# EAGLE design adapter (EAGLE 9.3.0)
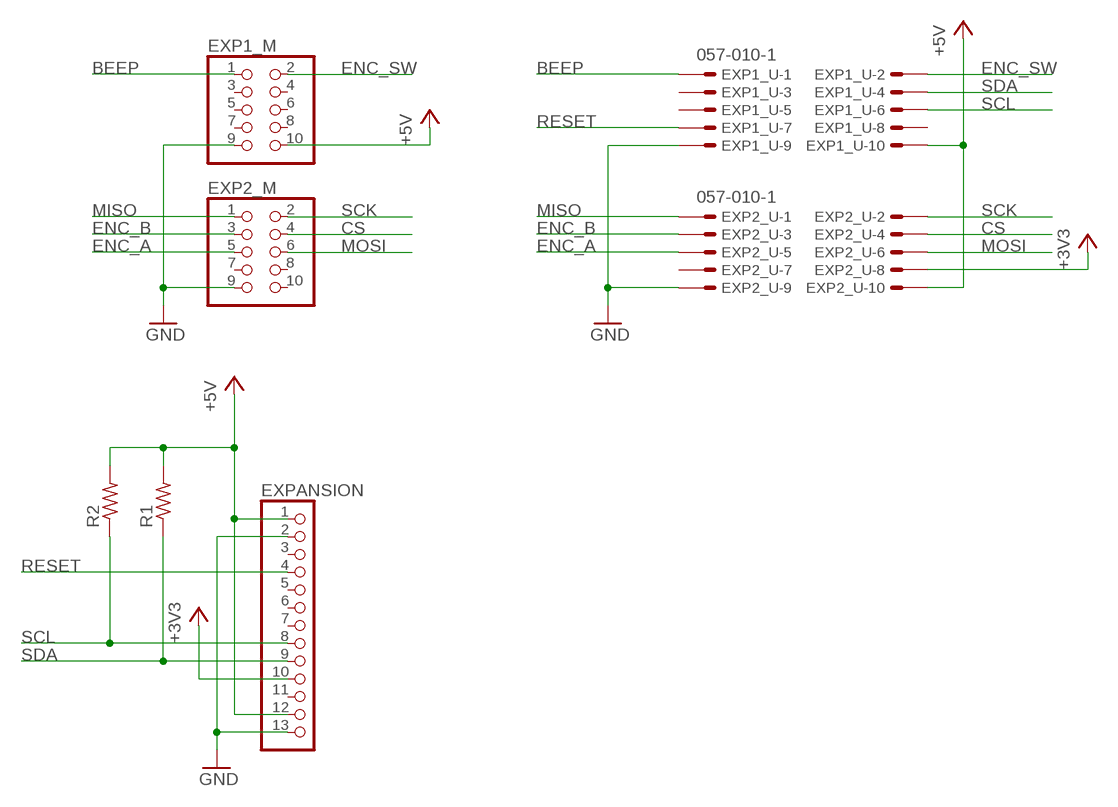
[diagram p0: schematic, sheet 1]

## Parts
EXP1_M  PINHD-2X5  [2X05]
EXP1_U  057-010-1  [057-010-1]
EXP2_M  PINHD-2X5  [2X05]
EXP2_U  057-010-1  [057-010-1]
EXPANSION  PINHD-1X13  [1X13]
R1  R-US_0204/7  [0204/7]
R2  R-US_0204/7  [0204/7]

## Nets
+3V3: EXP2_U.8 EXPANSION.10
+5V: EXP1_M.10 EXP1_U.10 EXP2_U.10 EXPANSION.1 EXPANSION.12 R1.2 R2.2
BEEP: EXP1_M.1 EXP1_U.1
CS: EXP2_M.4 EXP2_U.4
ENC_A: EXP2_M.5 EXP2_U.5
ENC_B: EXP2_M.3 EXP2_U.3
ENC_SW: EXP1_M.2 EXP1_U.2
GND: EXP1_M.9 EXP1_U.9 EXP2_M.9 EXP2_U.9 EXPANSION.2 EXPANSION.13
MISO: EXP2_M.1 EXP2_U.1
MOSI: EXP2_M.6 EXP2_U.6
RESET: EXP1_U.7 EXPANSION.4
SCK: EXP2_M.2 EXP2_U.2
SCL: EXP1_U.6 EXPANSION.8 R2.1
SDA: EXP1_U.4 EXPANSION.9 R1.1
Unconnected: EXP1_M.3 EXP1_M.4 EXP1_M.5 EXP1_M.6 EXP1_M.7 EXP1_M.8 EXP1_U.3 EXP1_U.5 EXP1_U.8 EXP2_M.7 EXP2_M.8 EXP2_M.10 EXP2_U.7 EXPANSION.3 EXPANSION.5 EXPANSION.6 EXPANSION.7 EXPANSION.11

## Library data of the parts
EXP1_M EXP2_M = pinhead:PINHD-2X5: PIN HEADER
EXP1_U EXP2_U = con-panduit:057-010-: CONNECTOR 10-pin series 057 contact pc board low profile headers; OC_FARNELL: unknown; OC_NEWARK: unknown
EXPANSION = pinhead:PINHD-1X13: PIN HEADER
R1 R2 = resistor:R-US_: RESISTOR, American symbol

## Board
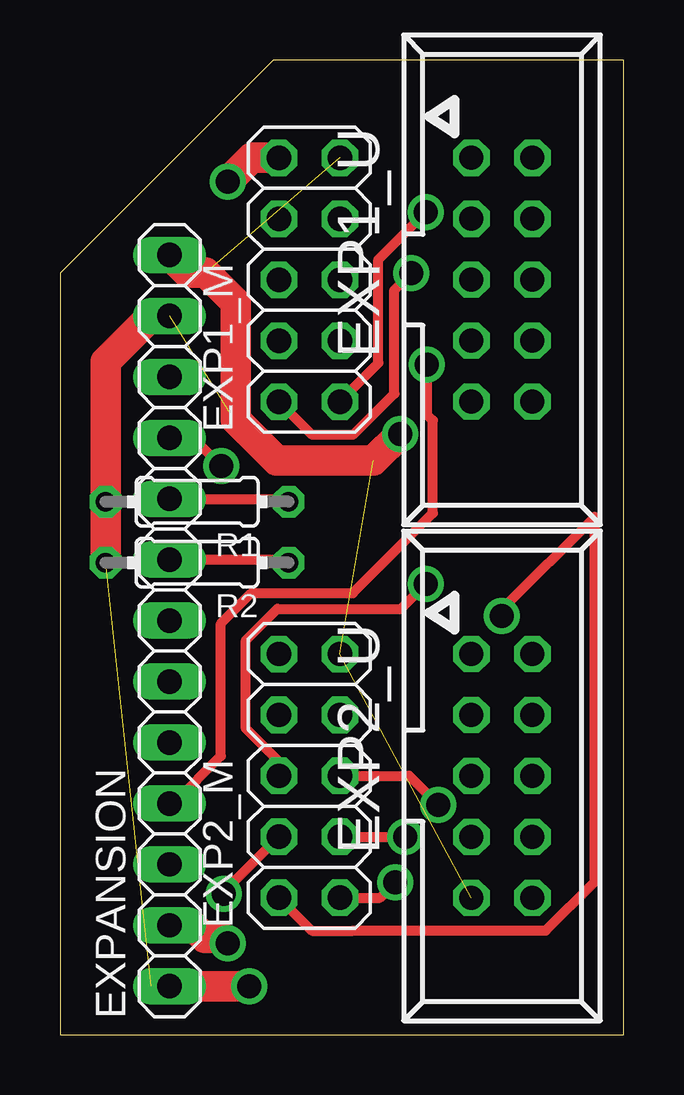
[diagram p1: board, top side]
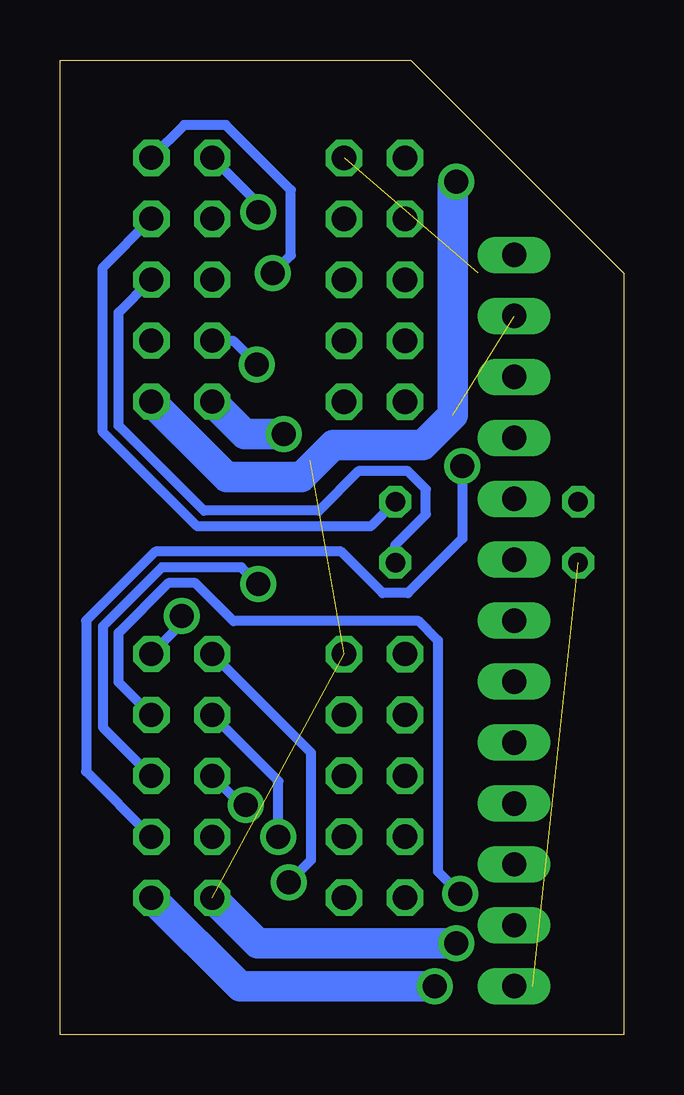
[diagram p2: board, bottom side, seen from below]

Size 23.5 x 40.64 mm. Coordinates in mm from the lower left corner, seen from the top.
Outline: 23.5,0 23.5,40.64 8.89,40.64 0,31.75 0,0 23.5,0
Copper layers (1*16): Top 0.035mm / dielectric 1.5mm / Bottom 0.035mm
Design rules "default *": minimum track width 6mil, minimum drill 0.4mm, track to track 10mil, track to pad 16mil, pad to pad 10mil, via to via 16mil, smd to smd 10mil, copper to edge 40mil, drill to drill 6mil, minimum pad ring 10mil, minimum via ring 8mil, stop-mask expansion 4mil, vias tented up to drill 0mil, thermal gap 10mil

### Footprints (pad centres in the part's own frame; a part is rotated, then mirrored left to right if it is on the bottom)
2X05 = drill 1.016 octagon: 1 -5.08,-1.27; 2 -5.08,1.27; 3 -2.54,-1.27; 4 -2.54,1.27; 5 0,-1.27; 6 0,1.27; 7 2.54,-1.27; 8 2.54,1.27; 9 5.08,-1.27; 10 5.08,1.27
057-010-1 = drill 1 octagon: 1 -5.08,-1.27; 2 -5.08,1.27; 3 -2.54,-1.27; 4 -2.54,1.27; 5 0,-1.27; 6 0,1.27; 7 2.54,-1.27; 8 2.54,1.27; 9 5.08,-1.27; 10 5.08,1.27
1X13 = drill 1.016 long: 1 -15.24,0; 2 -12.7,0; 3 -10.16,0; 4 -7.62,0; 5 -5.08,0; 6 -2.54,0; 7 0,0; 8 2.54,0; 9 5.08,0; 10 7.62,0; 11 10.16,0; 12 12.7,0; 13 15.24,0
0204/7 = drill 0.813 octagon: 1 -3.81,0; 2 3.81,0

### Placement (x,y rotation side)
EXP1_M  10.39,31.48 90 top
EXP1_U  18.41,31.48 270 top
EXP2_M  10.39,10.8 90 top
EXP2_U  18.41,10.8 270 top
EXPANSION  4.57,17.27 90 top
R1  5.72,22.22 180 top
R2  5.72,19.69 180 top

### Tracks (layer width: path | path; a pad name or v marks a point on that pad's centre or on a via)
+3V3  (via drill 1)
  Top 0.406: v6.73,23.71 5.55,24.89 EXPANSION.10
  Bottom 0.406: EXP2_U.8 22.4,10.98 22.4,17.27 19.53,20.15 11.78,20.15 10.05,18.41 9,18.41 6.73,20.69 v6.73,23.71 6.73,23.62
+5V  (via drill 1)  (2 unrouted)
  Top 1.27: 3.8,2.03 EXPANSION.1 v7.89,2.03 | R2.2 R1.2 1.91,28.08 3.8,29.97 EXPANSION.12 | EXP1_M.10 7.98,36.56 v6.98,35.56
  Bottom 1.27: EXP1_U.10 16.55,23.26 13.44,23.26 12.1,24.59 8.37,24.59 7.13,25.83 7.13,35.41 v6.98,35.56 | v7.89,2.03 16,2.03 EXP2_U.10
BEEP  (via drill 1)
  Top 0.406: EXP1_M.1 13.27,28.01 13.27,32.32 v15.24,34.29 v15.23,34.29
  Bottom 0.406: v15.23,34.29 15.23,34.65 EXP1_U.1
CS  (via drill 1)
  Top 0.406: EXP2_M.4 6.82,5.96 v6.82,5.88
  Bottom 0.406: EXP2_U.4 21.05,14.7 21.05,16.76 18.98,18.83 17.85,18.83 16.27,17.25 8.55,17.25 7.75,16.45 7.75,6.81 v6.82,5.88
ENC_A  (via drill 1)
  Top 0.406: EXP2_M.5 14.55,10.8 v15.75,9.59
  Bottom 0.406: v15.75,9.59 15.94,9.59 EXP2_U.5
ENC_B  (via drill 1)
  Top 0.406: EXP2_M.3 v14.39,8.26
  Bottom 0.406: v14.39,8.26 14.39,10.58 EXP2_U.3
ENC_SW  (via drill 1)
  Top 0.406: EXP1_M.2 10.49,25.03 12.23,25.03 13.93,26.73 13.93,31.05 v14.63,31.75
  Bottom 0.406: EXP1_U.2 18.32,37.92 16.58,37.92 13.88,35.22 13.88,32.5 v14.63,31.75
GND  (via drill 1)  (3 unrouted)
  Top 1.27: EXPANSION.13 5.31,31.77 6.08,31.77 7.32,30.53 7.32,25.65 9.03,23.93 13.06,23.93 v14.18,25.05 | EXPANSION.2 5.51,4.57 6.03,4.05 6.76,4.05 v6.98,3.82
  Bottom 1.27: v14.18,25.05 15.8,25.05 EXP1_U.9 | v6.98,3.82 15.25,3.82 EXP2_U.9
MISO  (via drill 1)
  Top 0.406: EXP2_M.1 13.34,5.72 v13.97,6.35
  Bottom 0.406: v13.97,6.35 13.03,7.29 13.03,11.77 EXP2_U.1
MOSI  (via drill 1)
  Top 0.406: EXP2_M.6 9.12,11.4 7.75,12.77 7.75,16.45 9.06,17.75 14.2,17.75 v15.24,18.79
  Bottom 0.406: EXP2_U.6 21.71,12.82 21.71,17.03 19.25,19.49 15.94,19.49 v15.24,18.79
RESET  (via drill 1)
  Top 0.406: v15.29,27.94 15.29,25.86 15.54,25.62 15.54,21.75 12.2,18.41 7.97,18.41 6.7,17.14 6.7,11.62 4.73,9.65 EXPANSION.4
  Bottom 0.406: EXP1_U.7 16.29,28.94 v15.29,27.94
SCK  (via drill 1)
  Top 0.406: EXP2_M.2 10.49,4.35 12.23,4.35 12.24,4.35 20.25,4.35 22.28,6.38 22.28,21.59 18.41,17.73 v18.41,17.47
  Bottom 0.406: v18.41,17.47 18.41,17.15 EXP2_U.2
SCL
  Top 0.406: EXPANSION.8 9.4,19.81 R2.1
  Bottom 0.406: EXP1_U.6 21.05,30.11 21.05,25.4 17.5,21.85 12.7,21.85 11.06,23.49 9,23.49 8.25,22.75 8.25,21.7 9.53,20.43 R2.1
SDA
  Top 0.406: EXPANSION.9 9.4,22.35 R1.1
  Bottom 0.406: EXP1_U.4 21.71,31.99 21.71,25.13 17.78,21.19 10.56,21.19 R1.1